# EasyEDA Pro project MIW_V3.eprj

# Schematic Main Board
Create Date: 2024-01-22; Page Name: P1; Project Name: MIW_V3; Schematic Name: Main Board; Update Date: 2024-01-23; Company: EasyEDA.com; Drawed: EasyEDA Pro; Page Size: A; Part Number: NPMIW3; Version: V0.1
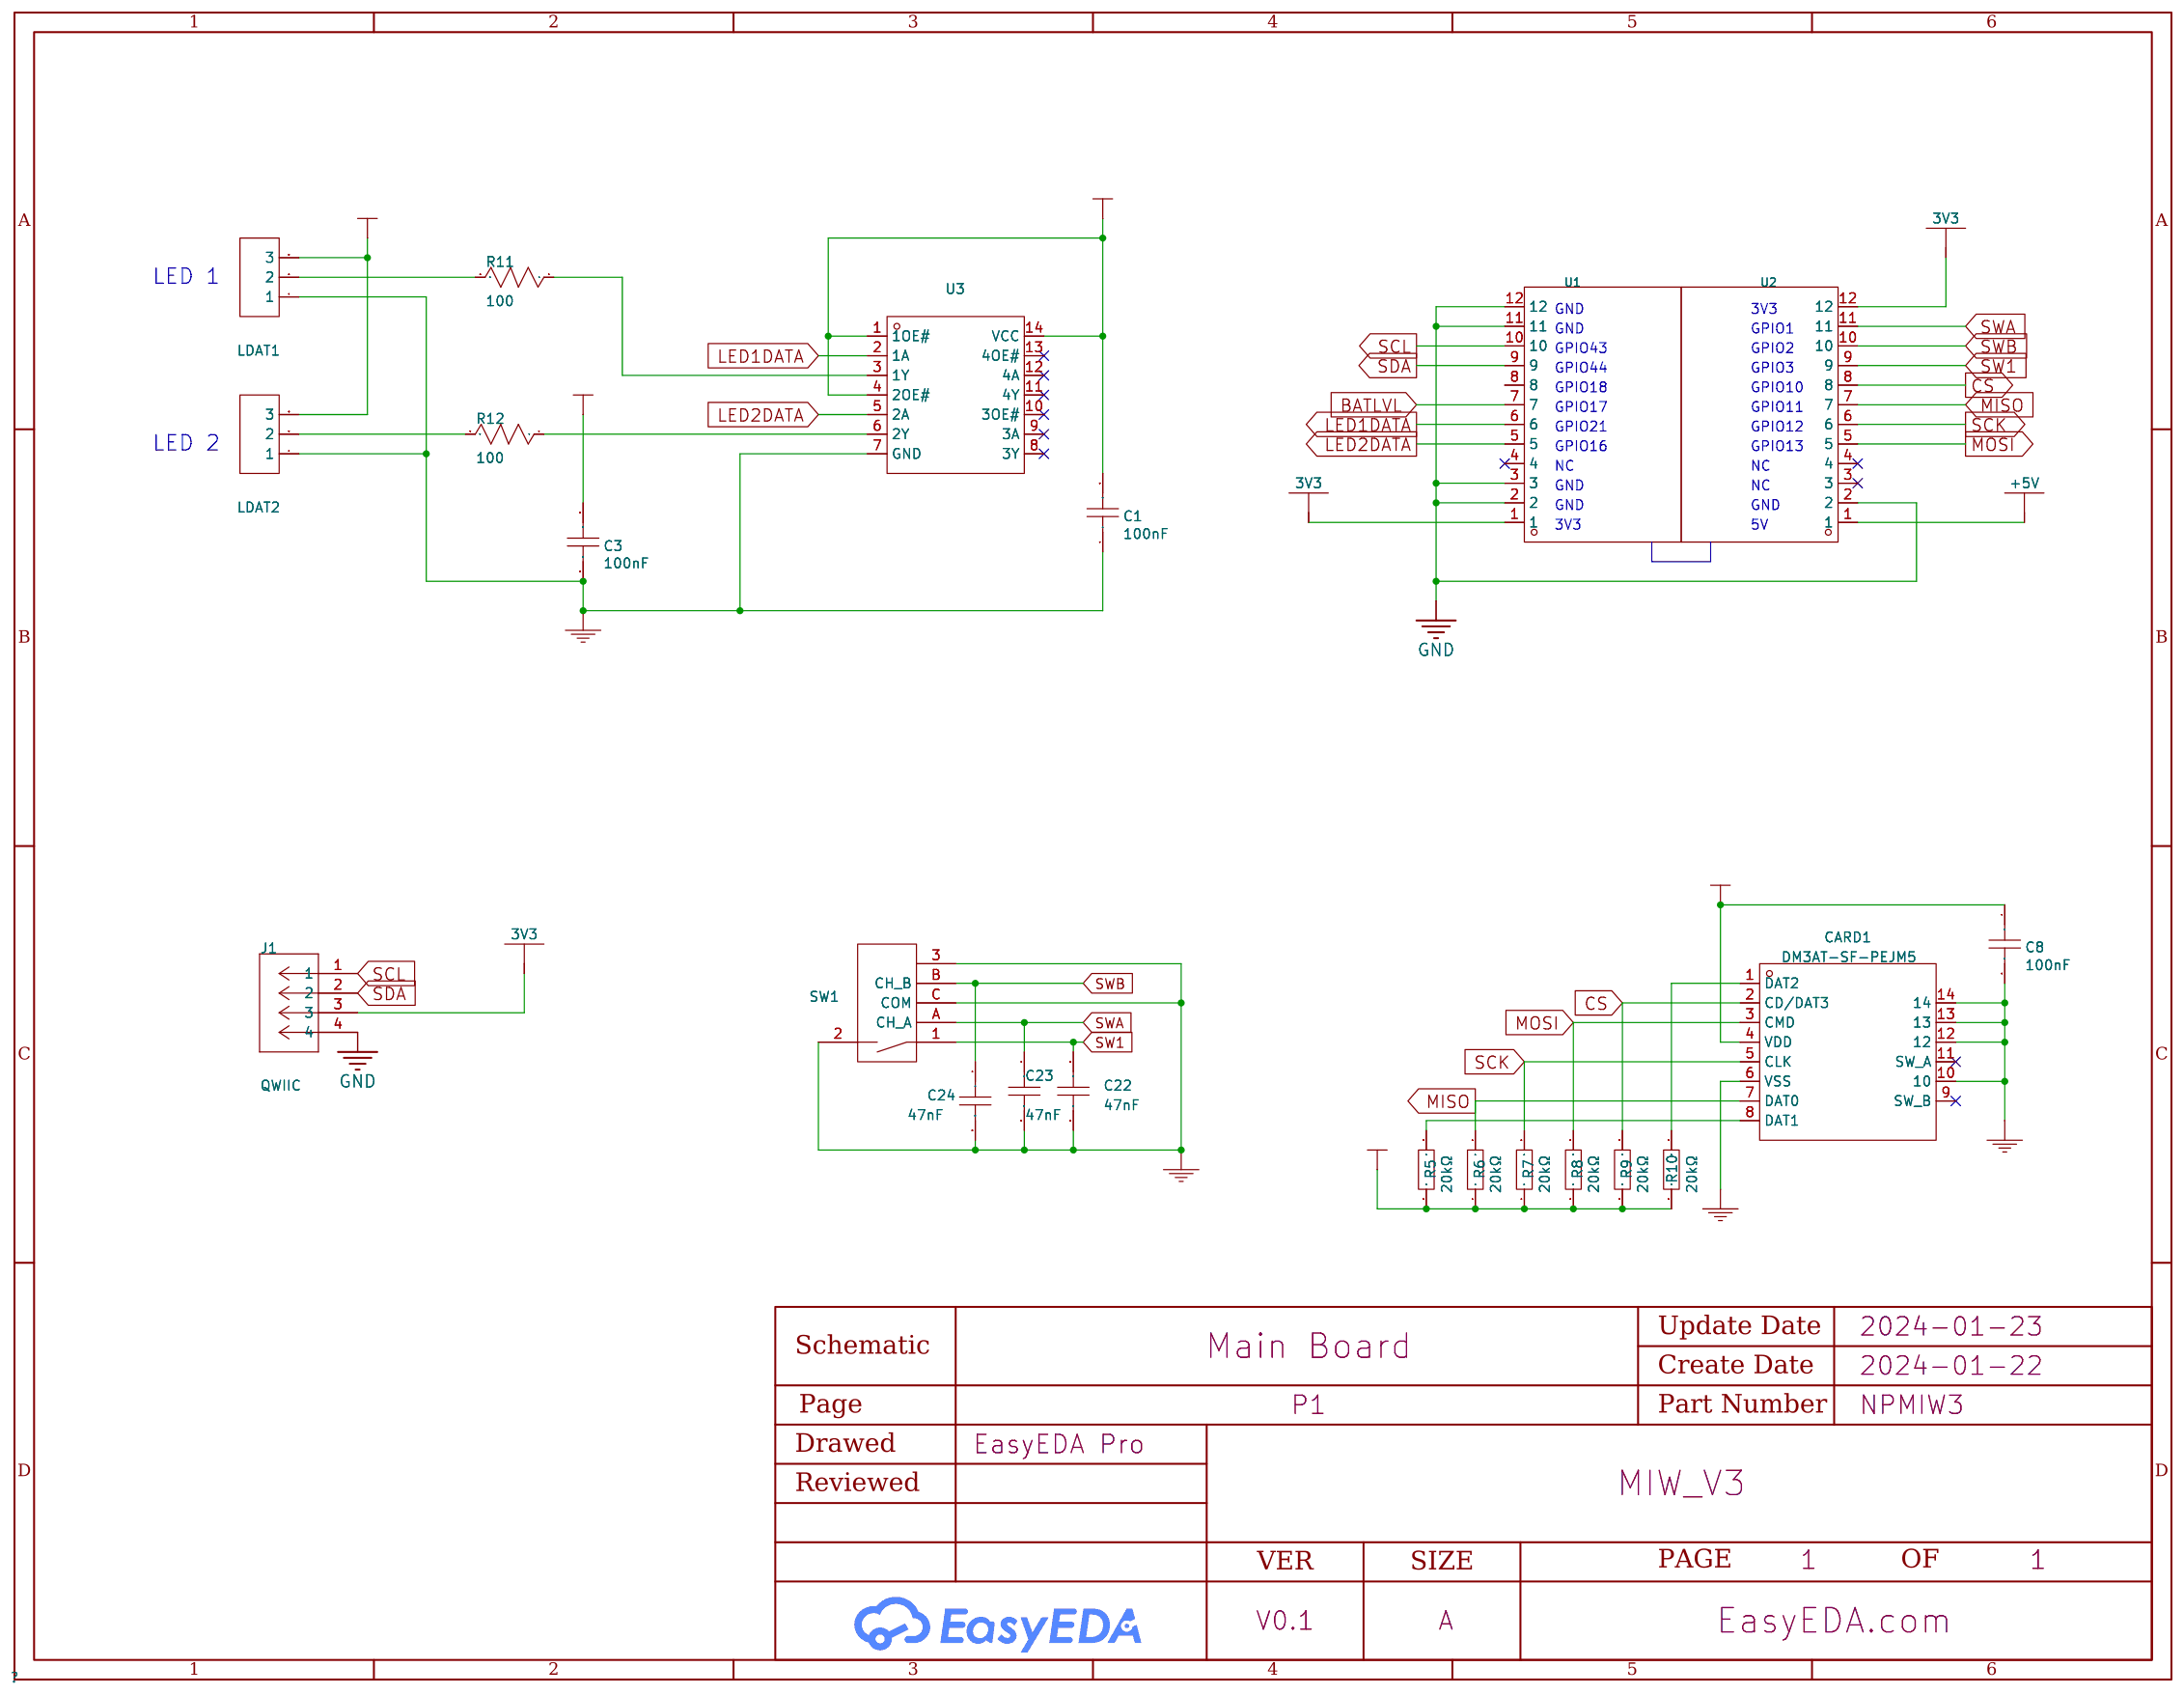
[diagram p0: schematic sheet]

## Parts
C1  100nF  [C0603]
C3  100nF  [C0603]
C8  100nF  [C0603]
C22  47nF  [C0402]
C23  47nF  [C0402]
C24  47nF  [C0402]
CARD1  DM3AT-SF-PEJM5  [SD-SMD_DM3AT-SF-PEJM5]
J1  PRT-16766  [CONN_BM04B-SRSS-TB_SPK]
LDAT1  HDR-M-2.54_1x3  [HDR-M-2.54_1X3]  (no BOM)
LDAT2  HDR-M-2.54_1x3  [HDR-M-2.54_1X3]  (no BOM)
R5  20kΩ  [R0402]
R6  20kΩ  [R0402]
R7  20kΩ  [R0402]
R8  20kΩ  [R0402]
R9  20kΩ  [R0402]
R10  20kΩ  [R0402]
R11  100  [R0603]
R12  100  [R0603]
SW1  PEC11R-4220F-S0012  [SW-TH_PEC11R-4220F-S0012]
U1  ZX-PM2.54-1-12PY  [HDR-TH_12P-P2.54-V-F]
U2  ZX-PM2.54-1-12PY  [HDR-TH_12P-P2.54-V-F]
U3  74VHCT126AFT  [TSSOP-14_L5.0-W4.4-P0.65-LS6.4-BL]

## Library data of the parts
C1 C3 = 100nF: link: https://item.szlcsc.com/362304.html; 3DModel: C0603_L1.6-W0.8-H0.8; Supplier: LCSC; Supplier Part: C15725; Manufacturer: SAMSUNG; Manufacturer Part: CL10B104KC8NNNC
C8 = CL10B104KC8NNNC: Capacitance: Tolerance:±10% Tolerance:±10% Voltage Rated: Temperature Coefficient:; LCSC Part Name: 100nF ±10% 100V; Supplier Part: C15725; Manufacturer: SAMSUNG(三星); Supplier Footprint: 0603; JLCPCB Part Class: Extended Part; Datasheet: https://atta.szlcsc.com/upload/public/pdf/source/20160218/1457707763339.pdf; Supplier: LCSC; Tolerance: ±10%
C22-C24 = CGA2B2X5R1E473K050BA: Capacitance: Voltage Rated: Temperature Coefficient:; LCSC Part Name: 47nF 25V; Supplier Part: C3889999; Manufacturer: TDK; Supplier Footprint: 0402; Supplier: LCSC
CARD1 = DM3AT-SF-PEJM5: Operating Temperature Range:- Operating Temperature Range:- Maximum Body Height:- Contact Plating:- Connector Type:卡座 Card Type:MicroSD卡(TF卡) Welding Temperature (Max):- Contact Material:- Card Connection Mode:自弹式; Supplier Part: C114218; Manufacturer: HRS(广濑); Supplier Footprint: SMD; JLCPCB Part Class: Extended Part; Datasheet: https://atta.szlcsc.com/upload/public/pdf/source/20170707/1499425911622.pdf; Supplier: LCSC; Connector Type: 卡座; Card Type: MicroSD卡(TF卡); Card Connection Mode: 自弹式
J1 = PRT-16766: Manufacturer: SparkFun; Supplier: Mouser.com; Supplier Part: 474-PRT-16766
LDAT1 LDAT2 = HDR-M-2.54_1x3: Supplier Part: C180248; Supplier: LCSC
R5-R10 = RC0402FR-0720KL: Type:Thick Film Resistors Resistance: Tolerance:±1% Tolerance:±1% Power(Watts): Temperature Coefficient:±100ppm/℃ Temperature Coefficient:±100ppm/℃ Overload Voltage (Max): Operating Temperature Range:-55℃~+155℃ Operating Temperature Range:-55℃~+155℃; LCSC Part Name: 20kΩ ±1% 62.5mW; Supplier Part: C93942; Manufacturer: YAGEO(国巨); Supplier Footprint: 0402; JLCPCB Part Class: Extended Part; Datasheet: https://atta.szlcsc.com/upload/public/pdf/source/20171113/C93942_15105616763751116172.pdf; Supplier: LCSC; Type: Thick Film Resistors; Tolerance: ±1%; Temperature Coefficient: ±100ppm/℃; Operating Temperature Range: -55℃~+155℃; Resistance: 20K
R11 R12 = 100: link: https://item.szlcsc.com/137208.html; 3DModel: R0603_L1.6-W0.8-H0.8; Supplier Part: C22775; Supplier: LCSC; Manufacturer Part: 0603WAF1000T5E; Manufacturer: UniOhm
SW1 = PEC11R-4220F-S0012: LCSC Part Name: PEC11R-4220F-S0012（三件套）; Supplier Part: C143817; Manufacturer: BOURNS; Supplier Footprint: 插件; JLCPCB Part Class: Extended Part; Datasheet: https://atta.szlcsc.com/upload/public/pdf/source/20171128/C143817_15118626936631147315.pdf; Supplier: LCSC
U1 U2 = ZX-PM2.54-1-12PY: Holes Structure:1x12P Pitch:2.54mm Row Spacing:- Circular Hole / Square Hole:方孔 Mounting Type:Straight Number of Rows:Plugin Number of Holes:12P Current Rating (Max):3A Voltage Rating (Max):1kV Holes Direction:Top Insulation Height:8.5mm Contact Material:; LCSC Part Name: 间距:2.54mm 1x12P 直插; Supplier Part: C7499331; Manufacturer: Megastar(兆星); Supplier Footprint: 插件,P=2.54mm; Datasheet: https://atta.szlcsc.com/upload/public/pdf/source/20231122/4DF5FC11318BDF334424D1267D8F4D94.pdf; Supplier: LCSC; Holes Structure: 1x12P; Pitch: 2.54mm; Circular Hole / Square Hole: 方孔; Mounting Type: Straight; Number of Rows: Plugin; Number of Holes: 12P; Current Rating (Max): 3A; Voltage Rating (Max): 1kV; Holes Direction: Top; Insulation Height: 8.5mm; Contact Material: bronze; Contact Plating: Gold; Operating Temperature Range: -40℃~+105℃; Welding Temperature (Max): 260℃@5S; Check: true
U3 = 74VHCT126AFT: Type:Buffers，非反相 Supply Voltage:4.5V~5.5V Supply Voltage:4.5V~5.5V Input type:- output type:Tri-State Current-OutputLow:8mA Current-OutputHigh:8mA Operating temperature:-40℃~+125℃ Operating temperature:-40℃~+125℃; Supplier Part: C8158; Manufacturer: TOSHIBA(东芝); Supplier Footprint: TSSOP-14; JLCPCB Part Class: Extended Part; Datasheet: https://atta.szlcsc.com/upload/public/pdf/source/20120504/1457706486581.pdf; Supplier: LCSC; Type: Buffers，非反相; Supply Voltage: 4.5V~5.5V; output type: Tri-State; Current-OutputLow: 8mA; Current-OutputHigh: 8mA; Operating temperature: -40℃~+125℃; link: https://item.szlcsc.com/8137.html; 3DModel: TSSOP-14_L5.0-W4.4-H1.0-LS6.4-P0.65

## Nets
3V3: C8.1 CARD1.4(VDD) J1.3 R5.1 R6.1 R7.1 R8.1 R9.1 R10.1 U1.1 U2.12
+5V: C1.2 C3.2 LDAT1.3 LDAT2.3 U2.1 U3.1(1OE#) U3.4(2OE#) U3.14(VCC)
GND: C1.1 C3.1 C8.2 C22.2 C23.2 C24.2 CARD1.6(VSS) CARD1.10 CARD1.12 CARD1.13 CARD1.14 J1.4 LDAT1.1 LDAT2.1 SW1.2 SW1.3 SW1.C(COM) U1.2 U1.3 U1.11 U1.12 U2.2 U3.7(GND)
BATLVL: U1.7
CS: CARD1.2(CD/DAT3) R9.2 U2.8
LED1DATA: U1.6 U3.2(1A)
LED2DATA: U1.5 U3.5(2A)
MISO: CARD1.7(DAT0) R6.2 U2.7
MOSI: CARD1.3(CMD) R8.2 U2.5
SCK: CARD1.5(CLK) R7.2 U2.6
SCL: J1.1 U1.10
SDA: J1.2 U1.9
SW1: C22.1 SW1.1 U2.9
SWA: C23.1 SW1.A(CH) U2.11
SWB: C24.1 SW1.B(CH) U2.10
$1N1057: CARD1.8(DAT1) R5.2
$1N1059: CARD1.1(DAT2) R10.2
$1N5328: R12.1 U3.6(2Y)
$1N12886: LDAT2.2 R12.2
$1N13075: R11.1 U3.3(1Y)
$1N13084: LDAT1.2 R11.2

Not connected (* = marked no-connect by the designer): CARD1 9(SW_B)* 11(SW_A)*; U1 4* 8; U2 3* 4*; U3 8(3Y)* 9(3A)* 10(3OE#)* 11(4Y)* 12(4A)* 13(4OE#)*

## Notes on the sheet
- LED 1
- GND
- 3V3
- GND
- GPIO1
- GPIO43
- GPIO2
- GPIO44
- GPIO3
- GPIO17
- GPIO18
- GPIO10
- GPIO11
- GPIO21
- GPIO12
- LED 2
- GPIO16
- GPIO13
- NC
- NC
- GND
- NC
- 3V3
- GND
- 5V
- GND

# Board PCB1
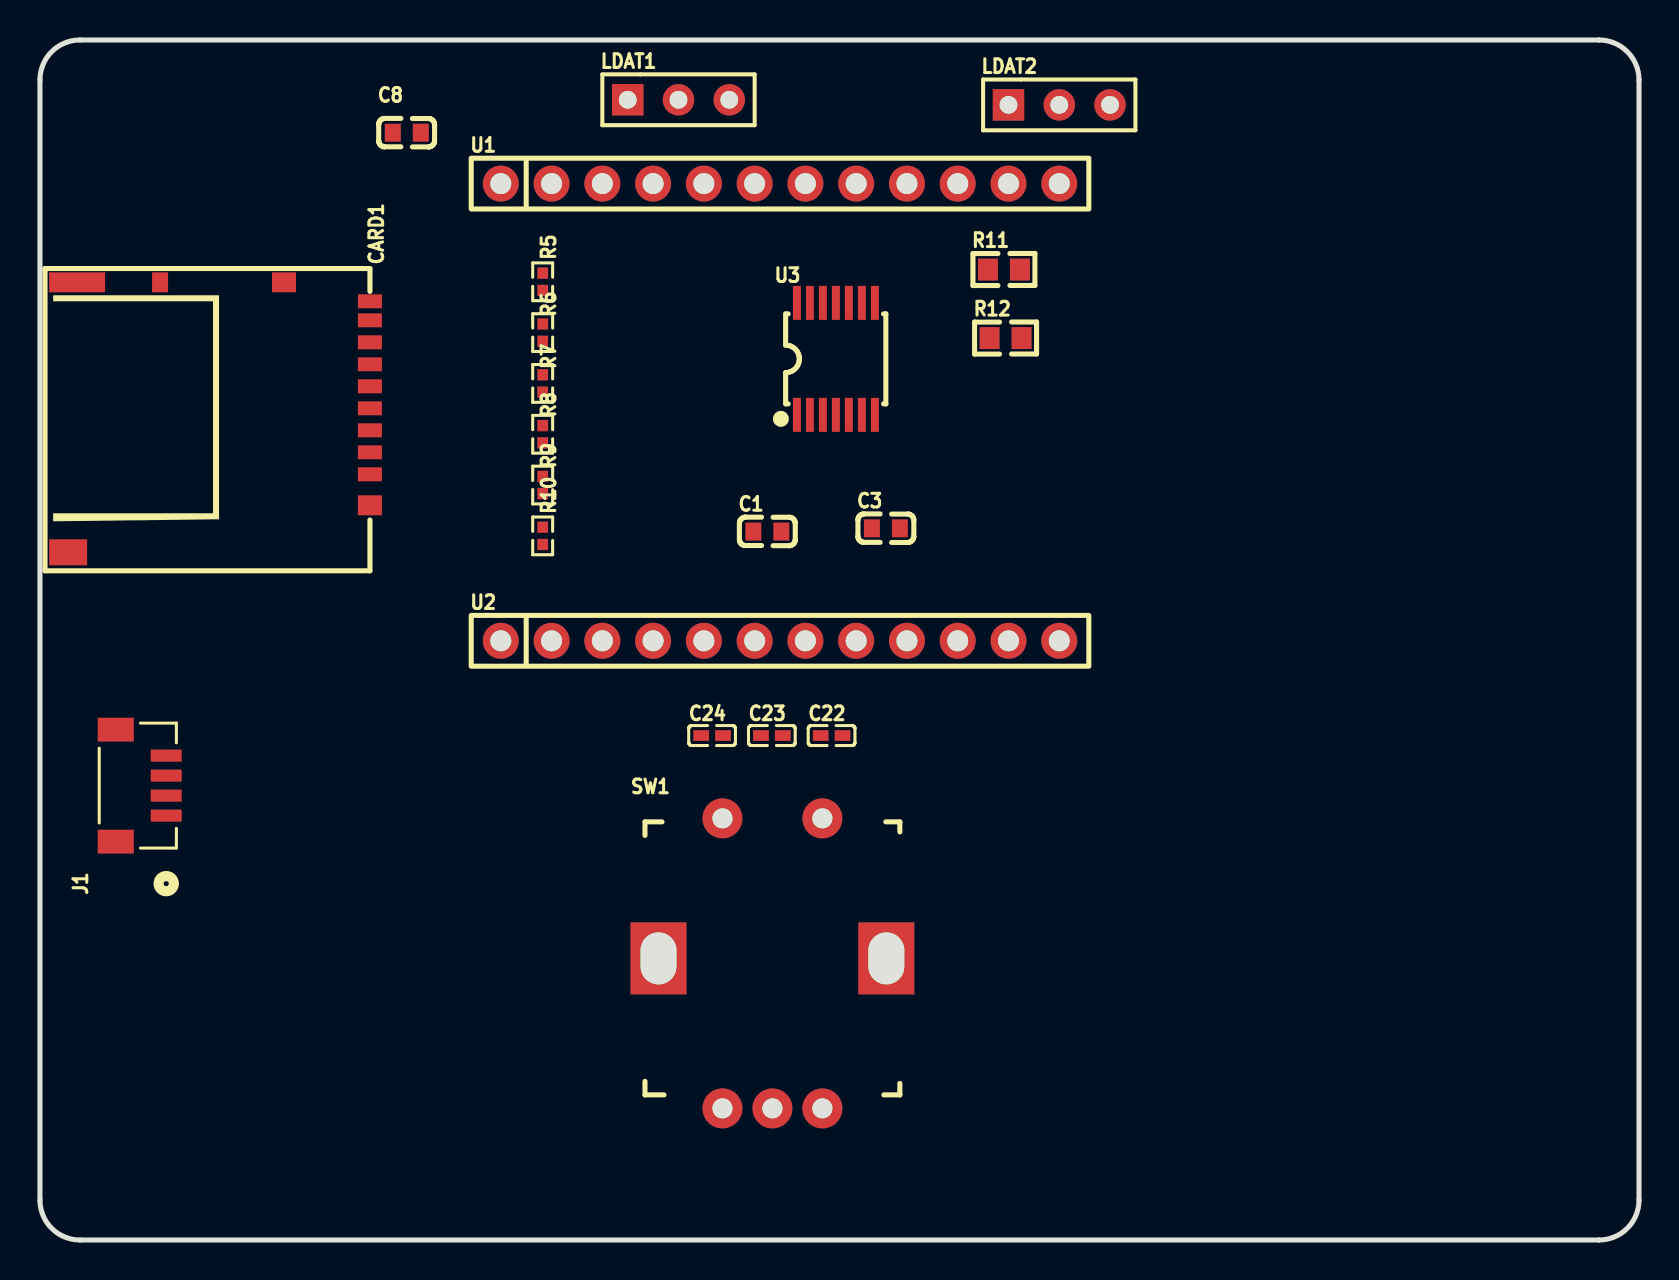
[diagram p1: board, top side]
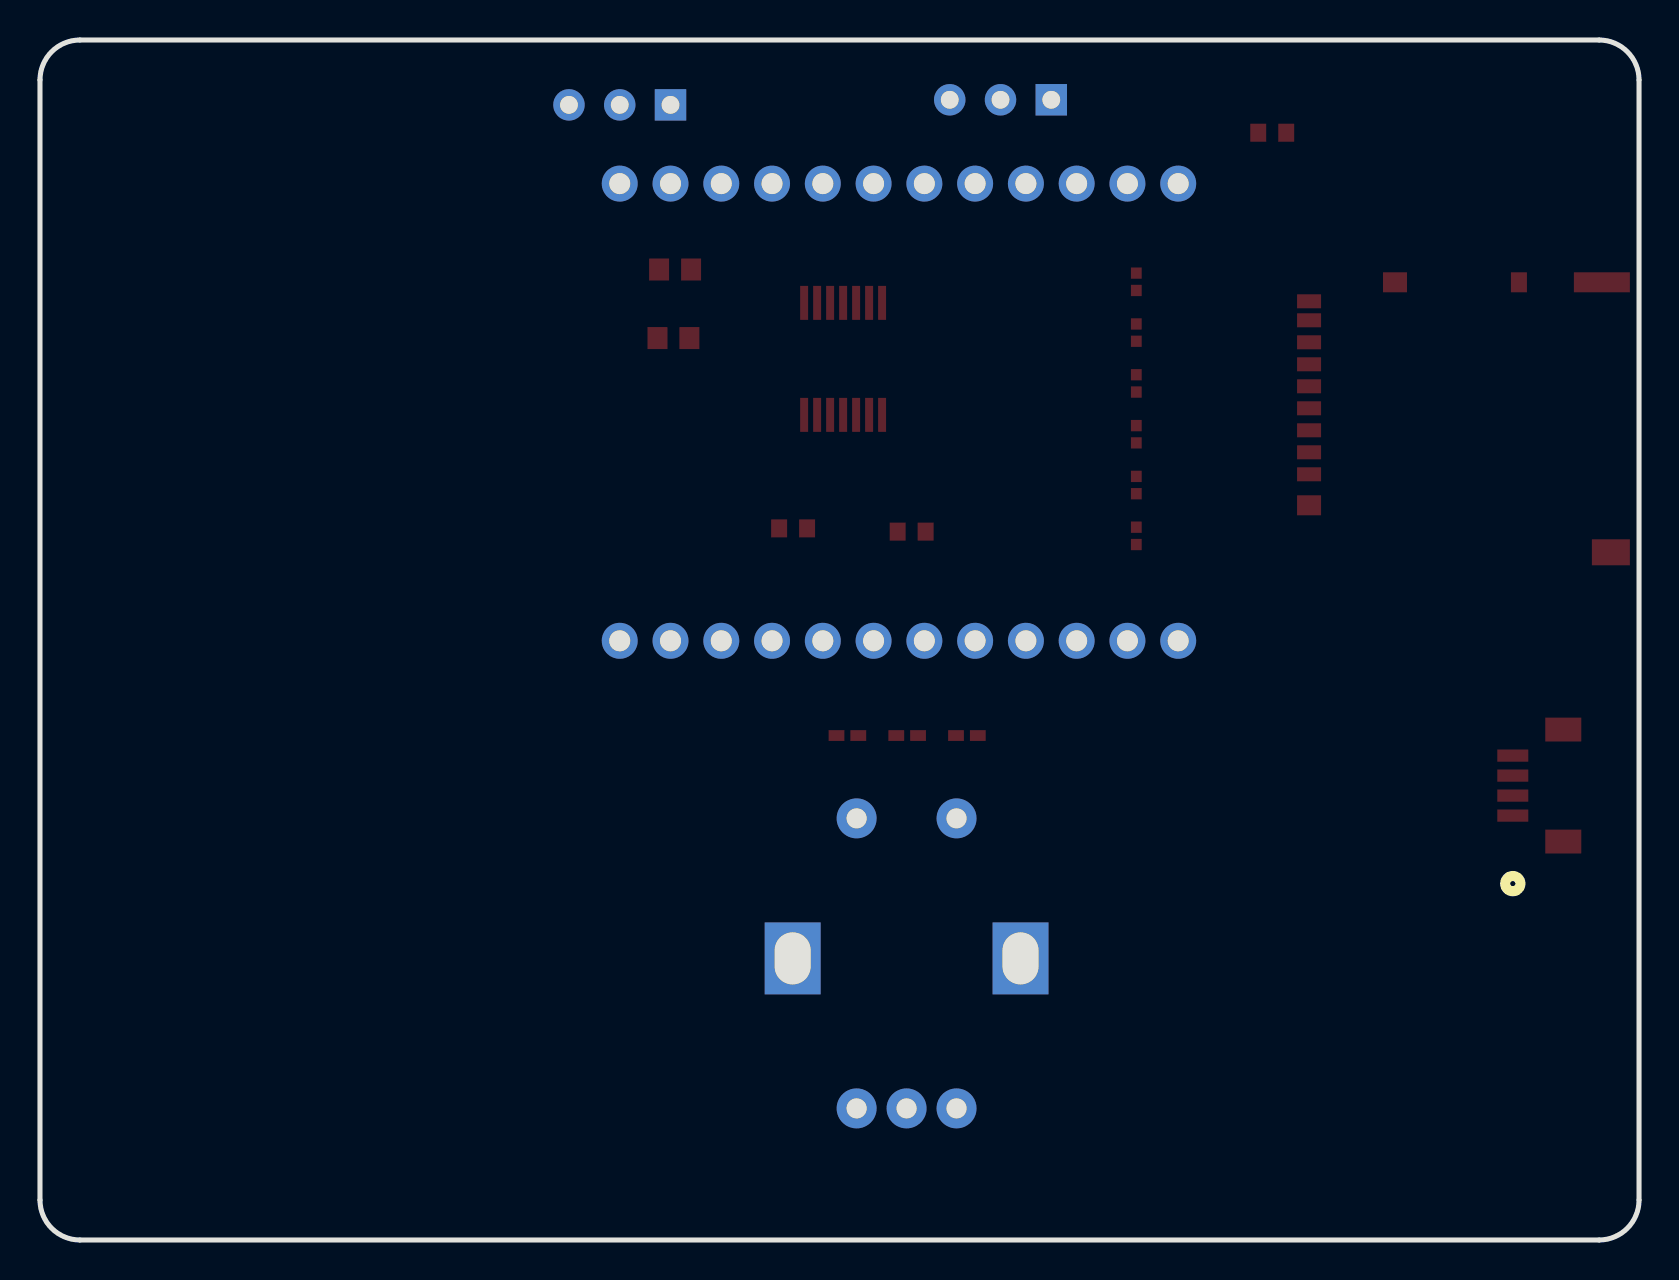
[diagram p2: board, bottom side, seen from below]

Outline 80 x 60 mm; copper layers: Top Layer, Bottom Layer. Coordinates in mm from the lower left corner of the outline.
Outline path: 0,58 arc(0.59,59.41) 2,60 78,60 arc(79.41,59.41) 80,58 80,2 arc(79.41,0.59) 78,0 2,0 arc(0.59,0.59) 0,2 0,58
Stack: Top Layer 0.035mm / Dielectric1 1.51mm FR4 er 4.5 / Bottom Layer 0.035mm

## Design rules (mm)
template: JLCPCB Capability(Two Layers Board)
spacing copperThickness1oz (default): track to track 0.102, other pairs 0.152 to 0.3
spacing copperThickness2oz: track to track 0.203, other pairs 0.152 to 0.3
track width copperThickness1oz (default): min 0.127, default 0.254, max 2.54
track width copperThickness2oz: min 0.203, default 0.254, max 2.54
differential pair differentialPair (default): width min 0.127, default 0.254, max 2.54; gap min 0.152, default 0.152
via viaSize (default): diameter min 0.5, default 0.61, max 10; hole min 0.3, default 0.305, max 6.3

## Placement (name value [footprint] x y rotation side)
C1  100nF  [C0603]  36.39 35.42 0 top
C3  100nF  [C0603]  42.32 35.58 0 top
C8  100nF  [C0603]  18.35 55.36 0 top
C22  47nF  [C0402]  39.61 25.22 0 top
C23  47nF  [C0402]  36.62 25.22 0 top
C24  47nF  [C0402]  33.63 25.22 0 top
CARD1  DM3AT-SF-PEJM5  [SD-SMD_DM3AT-SF-PEJM5]  8.96 41.14 270 top
J1  PRT-16766  [CONN_BM04B-SRSS-TB_SPK]  4.89 22.72 90 top
LDAT1  HDR-M-2.54_1x3  [HDR-M-2.54_1X3]  31.95 57.01 0 top
LDAT2  HDR-M-2.54_1x3  [HDR-M-2.54_1X3]  51 56.76 0 top
R5  20kΩ  [R0402]  25.15 47.91 270 top
R6  20kΩ  [R0402]  25.15 45.37 90 top
R7  20kΩ  [R0402]  25.15 42.83 270 top
R8  20kΩ  [R0402]  25.15 40.29 270 top
R9  20kΩ  [R0402]  25.15 37.75 270 top
R10  20kΩ  [R0402]  25.15 35.21 270 top
R11  100  [R0603]  48.23 48.52 0 top
R12  100  [R0603]  48.31 45.1 0 top
SW1  PEC11R-4220F-S0012  [SW-TH_PEC11R-4220F-S0012]  36.64 13.83 0 top
U1  ZX-PM2.54-1-12PY  [HDR-TH_12P-P2.54-V-F]  37.03 52.82 0 top
U2  ZX-PM2.54-1-12PY  [HDR-TH_12P-P2.54-V-F]  37.03 29.96 0 top
U3  74VHCT126AFT  [TSSOP-14_L5.0-W4.4-P0.65-LS6.4-BL]  39.82 44.06 0 top

## Footprints (pads in the part's own frame, mm; a bottom-side part is the same pattern mirrored in y, then rotated)
C0402
  rect 0.79x0.54 smd: 1(-0.545,0) 2(0.545,0)
C0603
  rect 0.8x0.9 smd: 1(-0.7,0) 2(0.7,0)
CONN_BM04B-SRSS-TB_SPK
  rect 0.61x1.55 smd: 1(-1.5,-1.421) 2(-0.5,-1.421) 3(0.5,-1.421) 4(1.5,-1.421)
  rect 1.194x1.804 smd: 5(-2.8,1.103) 6(2.8,1.103)
HDR-M-2.54_1X3
  rect 1.575x1.575 hole 0.889: 1(-2.54,0)
  round 1.575 hole 0.889: 2(0,0) 3(2.54,0)
HDR-TH_12P-P2.54-V-F
  round 1.8 hole 1.05: 1(-13.97,0) 2(-11.43,0) 3(-8.89,0) 4(-6.35,0) 5(-3.81,0) 6(-1.27,0) 7(1.27,0) 8(3.81,0) 9(6.35,0) 10(8.89,0) 11(11.43,0) 12(13.97,0)
R0402
  rect 0.566x0.54 smd: 1(-0.433,0) 2(0.433,0)
R0603
  rect 1x1.1 smd: 1(-0.8,0) 2(0.8,0)
SD-SMD_DM3AT-SF-PEJM5
  rect 0.7x1.2 smd: 1(2.85,7.55) 2(1.75,7.55) 3(0.65,7.55) 4(-0.45,7.55) 5(-1.55,7.55) 6(-2.65,7.55) 7(-3.75,7.55) 8(-4.85,7.55) 9(-5.8,7.55)
  rect 1x1.2 smd: 10(-6.75,3.25) 14(4.4,7.55)
  rect 1x0.8 smd: 11(-6.75,-2.95)
  rect 1x2.8 smd: 12(-6.75,-7.1)
  rect 1.3x1.9 smd: 13(6.75,-7.55)
SW-TH_PEC11R-4220F-S0012
  round 2 hole 1.005x1: 1(-2.499,7.25) 2(2.499,7.25) A(-2.499,-7.25) B(2.499,-7.25) C(0,-7.25)
  rect 2.8x3.6 hole 1.8x2.6: 3(-5.7,0.25) 3(5.7,0.25)
TSSOP-14_L5.0-W4.4-P0.65-LS6.4-BL
  rect 0.4x1.7 smd: 1(-1.95,-2.8) 2(-1.3,-2.8) 3(-0.65,-2.8) 4(0,-2.8) 5(0.65,-2.8) 6(1.3,-2.8) 7(1.95,-2.8) 8(1.95,2.8) 9(1.3,2.8) 10(0.65,2.8) 11(0,2.8) 12(-0.65,2.8) 13(-1.3,2.8) 14(-1.95,2.8)

## Nets
As in the schematic, except:
SCK: CARD1.5 J1.1 R7.2 U1.10 U2.6
SDT: J1.2 U1.9

Pads without a net: CARD1 9 11; J1 5 6; U1 4 8; U2 3 4; U3 8 9 10 11 12 13
